# EAGLE schematic attiny_x313 (EAGLE 9.2.2)
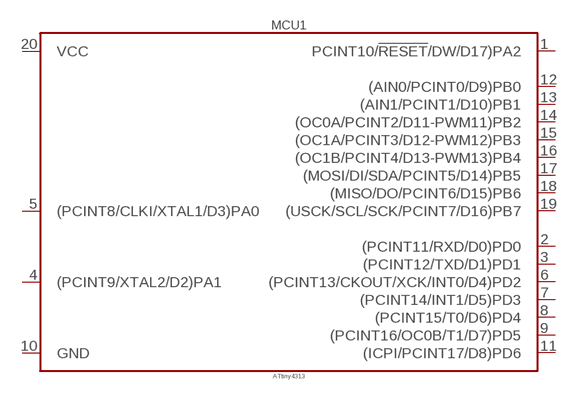
[diagram p0: schematic, sheet 1]

## Parts
MCU1  ATtiny4313  ATTINY-X313_DIP-20_ATTINY-4313  [DIP793W45P254L2573H533Q20B_DIP-20_ATTINY-X313]
Unconnected: MCU1.1(PCINT10/!RESET!/DW/D17)PA2) MCU1.2((PCINT11/RXD/D0)PD0) MCU1.3((PCINT12/TXD/D1)PD1) MCU1.4((PCINT9/XTAL2/D2)PA1) MCU1.5((PCINT8/CLKI/XTAL1/D3)PA0) MCU1.6((PCINT13/CKOUT/XCK/INT0/D4)PD2) MCU1.7((PCINT14/INT1/D5)PD3) MCU1.8((PCINT15/T0/D6)PD4) MCU1.9((PCINT16/OC0B/T1/D7)PD5) MCU1.10(GND) MCU1.11((ICPI/PCINT17/D8)PD6) MCU1.12((AIN0/PCINT0/D9)PB0) MCU1.13((AIN1/PCINT1/D10)PB1) MCU1.14((OC0A/PCINT2/D11-PWM11)PB2) MCU1.15((OC1A/PCINT3/D12-PWM12)PB3) MCU1.16((OC1B/PCINT4/D13-PWM13)PB4) MCU1.17((MOSI/DI/SDA/PCINT5/D14)PB5) MCU1.18((MISO/DO/PCINT6/D15)PB6) MCU1.19((USCK/SCL/SCK/PCINT7/D16)PB7) MCU1.20(VCC)

## Library data of the parts
MCU1 = PiB_ic_microcontrollers:ATTINY-X313; DATASHEET: http://www.microchip.com/mymicrochip/filehandler.aspx?ddocname=en590457; DIST: Digikey; DISTLINK: https://www.digikey.com/products/en?keywords=ATTINY4313-PU-ND; DISTPN: ATTINY4313-PU-ND; MFR: Microchip Technology; MPN: ATTINY4313-PU